# Altium schematic sheet TOP.SchDoc: Conexión General
size A4; Author: **; CompanyName: Introducción al Diseño de Circuitos Impresos; Organization: UTN FRBA; DocumentNumber: 1; Revision: 01; SheetNumber: 1; SheetTotal: 9; Autor: Eugenia Ipar
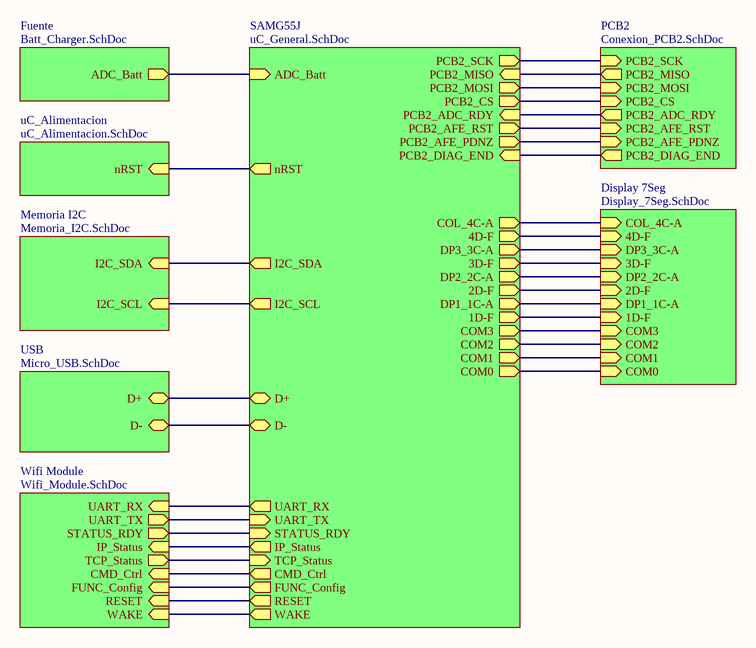
[diagram p0: TOP.SchDoc]

## Sub-sheets
Display 7Seg = Display_7Seg.SchDoc: COM0 (in), COM1 (in), COM2 (in), COM3 (in), 1D-F (in), DP1_1C-A (in), 2D-F (in), DP2_2C-A (in), 3D-F (in), DP3_3C-A (in), 4D-F (in), COL_4C-A (in)
Fuente = Batt_Charger.SchDoc: ADC_Batt (out)
Memoria I2C = Memoria_I2C.SchDoc: I2C_SDA (in), I2C_SCL (in)
PCB2 = Conexion_PCB2.SchDoc: PCB2_MOSI (in), PCB2_MISO (out), PCB2_AFE_RST (in), PCB2_DIAG_END (out), PCB2_CS (in), PCB2_AFE_PDNZ (in), PCB2_ADC_RDY (out), PCB2_SCK (in)
SAMG55J = uC_General.SchDoc: COM2 (out), DP3_3C-A (out), ADC_Batt (in), 3D-F (out), PCB2_ADC_RDY (in), PCB2_SCK (out), D+ (bidir), COM3 (out), DP2_2C-A (out), 4D-F (out), PCB2_AFE_PDNZ (out), PCB2_MISO (in), COM1 (out), 1D-F (out), DP1_1C-A (out), I2C_SCL (out), UART_RX (out), PCB2_AFE_RST (out), IP_Status (out), COL_4C-A (out), PCB2_DIAG_END (in), PCB2_MOSI (out), UART_TX (in), D- (bidir), I2C_SDA (out), COM0 (out), PCB2_CS (out), 2D-F (out), nRST (out), RESET (out), CMD_Ctrl (out), FUNC_Config (out), WAKE (out), STATUS_RDY (in), TCP_Status (in)
uC_Alimentacion = uC_Alimentacion.SchDoc: nRST (in)
USB = Micro_USB.SchDoc: D+ (bidir), D- (bidir)
Wifi Module = Wifi_Module.SchDoc: UART_RX (in), UART_TX (out), STATUS_RDY (out), IP_Status (in), TCP_Status (out), CMD_Ctrl (in), FUNC_Config (in), RESET (in), WAKE (in)

## Nets
(unnamed): sheet Memoria I2C/I2C_SDA, sheet SAMG55J/I2C_SDA
(unnamed): sheet Memoria I2C/I2C_SCL, sheet SAMG55J/I2C_SCL
(unnamed): sheet Fuente/ADC_Batt, sheet SAMG55J/ADC_Batt
(unnamed): sheet Wifi Module/UART_RX, sheet SAMG55J/UART_RX
(unnamed): sheet Wifi Module/UART_TX, sheet SAMG55J/UART_TX
(unnamed): sheet Wifi Module/STATUS_RDY, sheet SAMG55J/STATUS_RDY
(unnamed): sheet Wifi Module/IP_Status, sheet SAMG55J/IP_Status
(unnamed): sheet Wifi Module/TCP_Status, sheet SAMG55J/TCP_Status
(unnamed): sheet Wifi Module/CMD_Ctrl, sheet SAMG55J/CMD_Ctrl
(unnamed): sheet Wifi Module/FUNC_Config, sheet SAMG55J/FUNC_Config
(unnamed): sheet Wifi Module/RESET, sheet SAMG55J/RESET
(unnamed): sheet Wifi Module/WAKE, sheet SAMG55J/WAKE
(unnamed): sheet Display 7Seg/COM0, sheet SAMG55J/COM0
(unnamed): sheet Display 7Seg/COM1, sheet SAMG55J/COM1
(unnamed): sheet Display 7Seg/COM2, sheet SAMG55J/COM2
(unnamed): sheet Display 7Seg/COM3, sheet SAMG55J/COM3
(unnamed): sheet Display 7Seg/1D-F, sheet SAMG55J/1D-F
(unnamed): sheet Display 7Seg/DP1_1C-A, sheet SAMG55J/DP1_1C-A
(unnamed): sheet Display 7Seg/2D-F, sheet SAMG55J/2D-F
(unnamed): sheet Display 7Seg/DP2_2C-A, sheet SAMG55J/DP2_2C-A
(unnamed): sheet Display 7Seg/3D-F, sheet SAMG55J/3D-F
(unnamed): sheet Display 7Seg/DP3_3C-A, sheet SAMG55J/DP3_3C-A
(unnamed): sheet Display 7Seg/4D-F, sheet SAMG55J/4D-F
(unnamed): sheet Display 7Seg/COL_4C-A, sheet SAMG55J/COL_4C-A
(unnamed): sheet USB/D+, sheet SAMG55J/D+
(unnamed): sheet USB/D-, sheet SAMG55J/D-
(unnamed): sheet PCB2/PCB2_MOSI, sheet SAMG55J/PCB2_MOSI
(unnamed): sheet PCB2/PCB2_MISO, sheet SAMG55J/PCB2_MISO
(unnamed): sheet PCB2/PCB2_AFE_RST, sheet SAMG55J/PCB2_AFE_RST
(unnamed): sheet PCB2/PCB2_DIAG_END, sheet SAMG55J/PCB2_DIAG_END
(unnamed): sheet PCB2/PCB2_CS, sheet SAMG55J/PCB2_CS
(unnamed): sheet PCB2/PCB2_AFE_PDNZ, sheet SAMG55J/PCB2_AFE_PDNZ
(unnamed): sheet PCB2/PCB2_ADC_RDY, sheet SAMG55J/PCB2_ADC_RDY
(unnamed): sheet PCB2/PCB2_SCK, sheet SAMG55J/PCB2_SCK
(unnamed): sheet uC_Alimentacion/nRST, sheet SAMG55J/nRST

## Notes on the sheet
- Title:
- Size:
- Author:
- A4
- Sheet
- of
- Revision:
- File:
- Date: